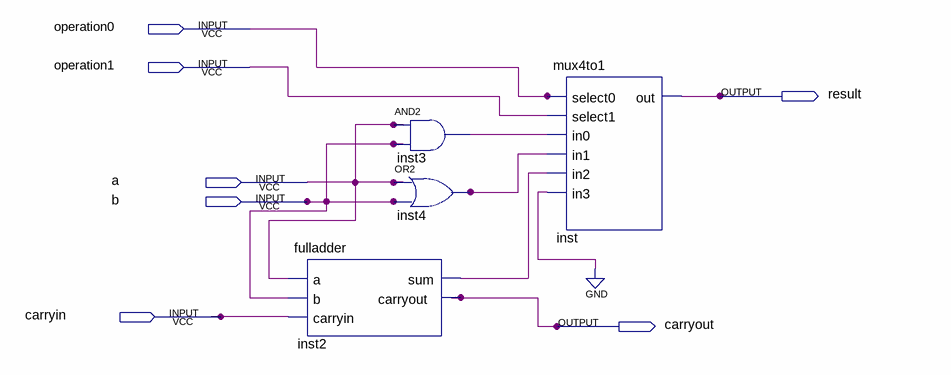
[diagram p0: schematic sheet]
// Quartus schematic alu1bit.bdf as structural Verilog: 4 symbols, 7 pins
module alu1bit (
  input  operation0,
  input  operation1,
  input  a,
  input  b,
  input  carryin,
  output result,
  output carryout
);

  wire inst2_sum, inst3_out, inst4_out;

  fulladder inst2 (.a(a), .b(b), .carryin(carryin), .sum(inst2_sum), .carryout(carryout));
  and inst3 (inst3_out, a, b);
  or inst4 (inst4_out, a, b);
  mux4to1 inst (
    .select0(operation0), .select1(operation1), .in0(inst3_out), .in1(inst4_out), .in2(inst2_sum),
    .in3(1'b0), .out(result));
endmodule
